# EAGLE design d7hb (EAGLE 7.2.0)
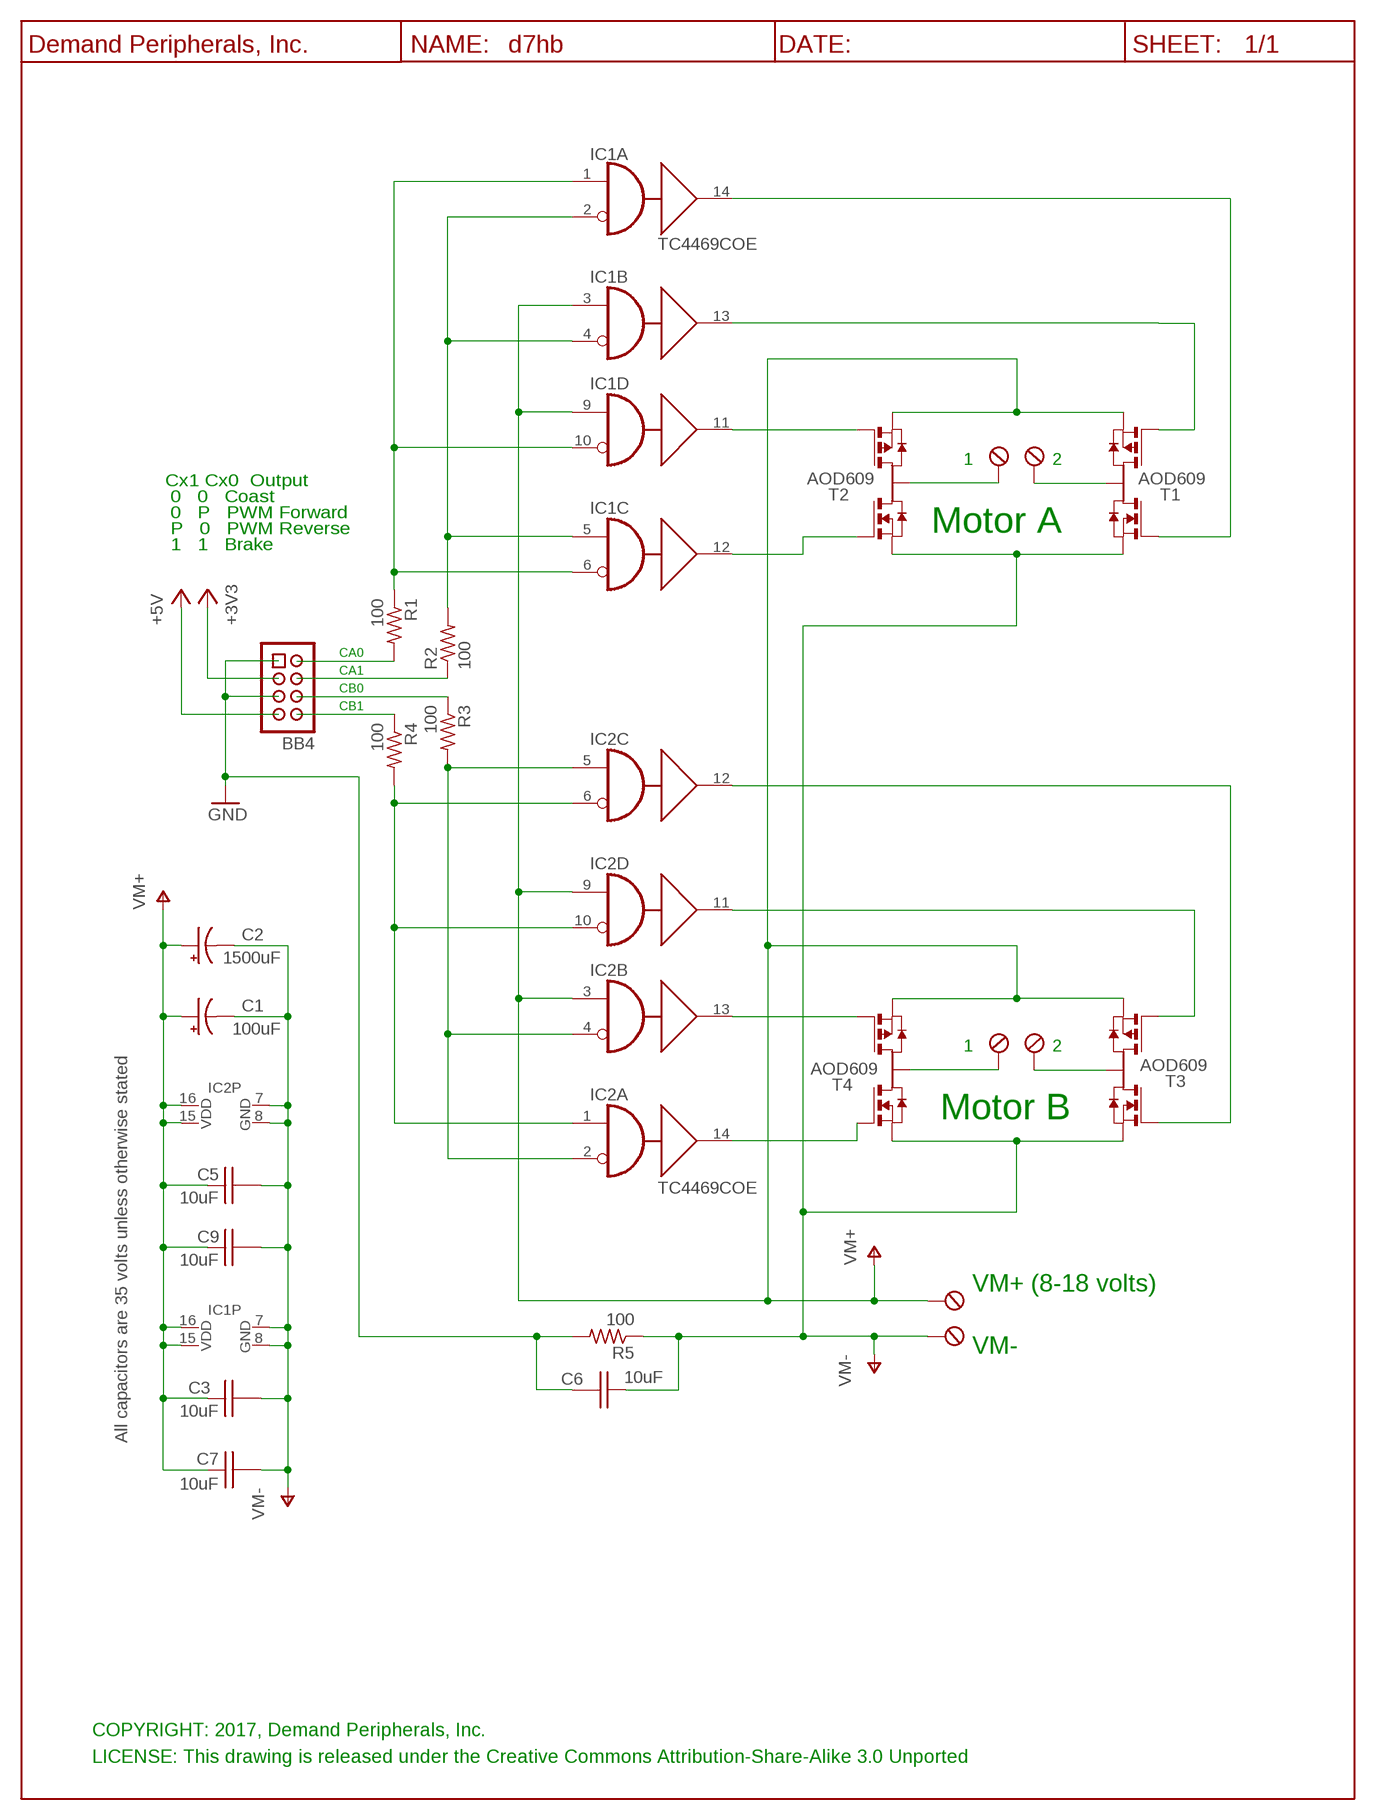
[diagram p0: schematic, sheet 1]

## Parts
BB4  BB_CON  HDR-4X2-SHR  [HDR-4X2]
C1  100uF  C100UF35V_E3.5-8  [E3.5-8]
C2  1500uF  C1500UF35V_E7,5-16  [E7,5-16]
C3  10uF  C10UF35V_C0805  [C0805]
C5  10uF  C10UF35V_C0805  [C0805]
C6  10uF  C10UF35V_C0805  [C0805]
C7  10uF  C10UF35V_C0805  [C0805]
C9  10uF  C10UF35V_C0805  [C0805]
CN1  OSTTC022162  TBLK-5.08-X2  [TBLK-5.08-X2]
CN2  OSTTC022162  TBLK-5.08-X2  [TBLK-5.08-X2]
CN3  OSTTC022162  TBLK-5.08-X2  [TBLK-5.08-X2]
IC1  TC4469COE  TC4469OESO-16DW  [SO-16DW]
IC2  TC4469COE  TC4469OESO-16DW  [SO-16DW]
R1  100  R100_R0603  [R0603]
R2  100  R100_R0603  [R0603]
R3  100  R100_R0603  [R0603]
R4  100  R100_R0603  [R0603]
R5  100  R100_R0603  [R0603]
T1  AOD609  [TO252-41]
T2  AOD609  [TO252-41]
T3  AOD609  [TO252-41]
T4  AOD609  [TO252-41]
U$1  DP_FRAME_P  [LETTER_P]

## Nets
+3V3: BB4.3
GND: BB4.1 BB4.5 C6.2 R5.2
N$1: IC1.12(C:Y) T2.2(G1N)
N$3: IC1.11(D:Y) T2.5(G2P)
N$4: IC1.13(B:Y) T1.5(G2P)
N$5: IC1.14(A:Y) T1.2(G1N)
N$6: IC2.13(B:Y) T4.5(G2P)
N$8: BB4.8 R4.1
N$9: IC2.14(A:Y) T4.2(G1N)
N$11: IC2.11(D:Y) T3.5(G2P)
N$12: BB4.2 R1.2
N$13: IC2.12(C:Y) T3.2(G1N)
N$15: BB4.4 R2.1
N$16: IC1.1(A:A) IC1.6(C:B) IC1.10(D:B) R1.1
N$17: IC1.2(A:B) IC1.4(B:B) IC1.5(C:A) R2.2
N$18: BB4.6 R3.1
N$20: IC2.1(A:A) IC2.6(C:B) IC2.10(D:B) R4.2
N$21: IC2.2(A:B) IC2.4(B:B) IC2.5(C:A) R3.2
N$85: CN3.1(KL) T2.CASE(D12)
N$86: CN3.2(KL1) T1.CASE(D12)
N$87: CN2.2(KL1) T4.CASE(D12)
N$88: CN2.1(KL) T3.CASE(D12)
V+: C1.+ C2.+ C3.1 C5.1 C7.1 C9.1 CN1.2(KL1) IC1.3(B:A) IC1.9(D:A) IC1.15(P:VDD) IC1.16(P:VDD) IC2.3(B:A) IC2.9(D:A) IC2.15(P:VDD) IC2.16(P:VDD) T1.4(S2P) T2.4(S2P) T3.4(S2P) T4.4(S2P) ; supply symbol labelled VM+
V-: C1.- C2.- C3.2 C5.2 C6.1 C7.2 C9.2 CN1.1(KL) IC1.7(P:GND) IC1.8(P:GND) IC2.7(P:GND) IC2.8(P:GND) R5.1 T1.1(S1N) T2.1(S1N) T3.1(S1N) T4.1(S1N) ; supply symbol labelled VM-
VCC: BB4.7 ; supply symbol labelled +5V

## Notes on the sheet
- 1 | 2
- Cx1 Cx0  Output
- 0   0   Coast
- 0   P   PWM Forward
- P   0   PWM Reverse | Motor A
- 1   1   Brake
- CA0
- CA1
- CB0
- CB1
- 1 | 2
- Motor B
- VM+ (8-18 volts)
- VM-
- All capacitors are 35 volts unless otherwise stated
- COPYRIGHT: 2017, Demand Peripherals, Inc.
- LICENSE: This drawing is released under the Creative Commons Attribution-Share-Alike 3.0 Unported

## Library data of the parts
BB4 = dpi-conn:HDR-4X2-SHR: Shrouded 4x2 pin header; VENDOR: Digikey; VENDOR-PART-NUM: 609-3530-ND
C1 = dpi-passive:C100UF35V_: 100uF polarized capacitor, 35 volts, general purpose; VENDOR: Digikey; VENDOR-PART-NUM: 399-6548-ND
C2 = dpi-passive:C1500UF35V_: 1500uF polarized capacitor, 35 volts, general purpose; VENDOR: Digikey; VENDOR-PART-NUM: 399-6559-ND
C3 C5-C7 C9 = dpi-passive:C10UF35V_: 10 uF Capacitor, 35V, X6S; VENDOR: Digikey; VENDOR-PART-NUM: 490-10504-2-ND
CN1-CN3 = dpi-conn:TBLK-5.08-X2: Terminal Block, 5.08mm, x2, screw terminals; VENDOR: Digikey; VENDOR-PART-NUM: ED2609-ND
IC1 IC2 = dpi-transic:TC4469OE: Logic-Input CMOS Quad Drivers Source: TC 4469-MOSFET-DRIVER.pdf; VENDOR: Digikey; VENDOR-PART-NUM: TC4469COE713CT-ND
R1-R5 = dpi-passive:R100_: 100 Ohm resistor, 1%, 0.1 watt; VENDOR: Digikey; VENDOR-PART-NUM: 311-100HRTR-ND
T1-T4 = dpi-transic:AOD609: DUAL N AND P-CHANNEL MOSFET; VENDOR: Digikey; VENDOR-PART-NUM: 785-1607-1-ND
U$1 = DP:DP_FRAME_P: Portrait/Letter Document Frame

## Board
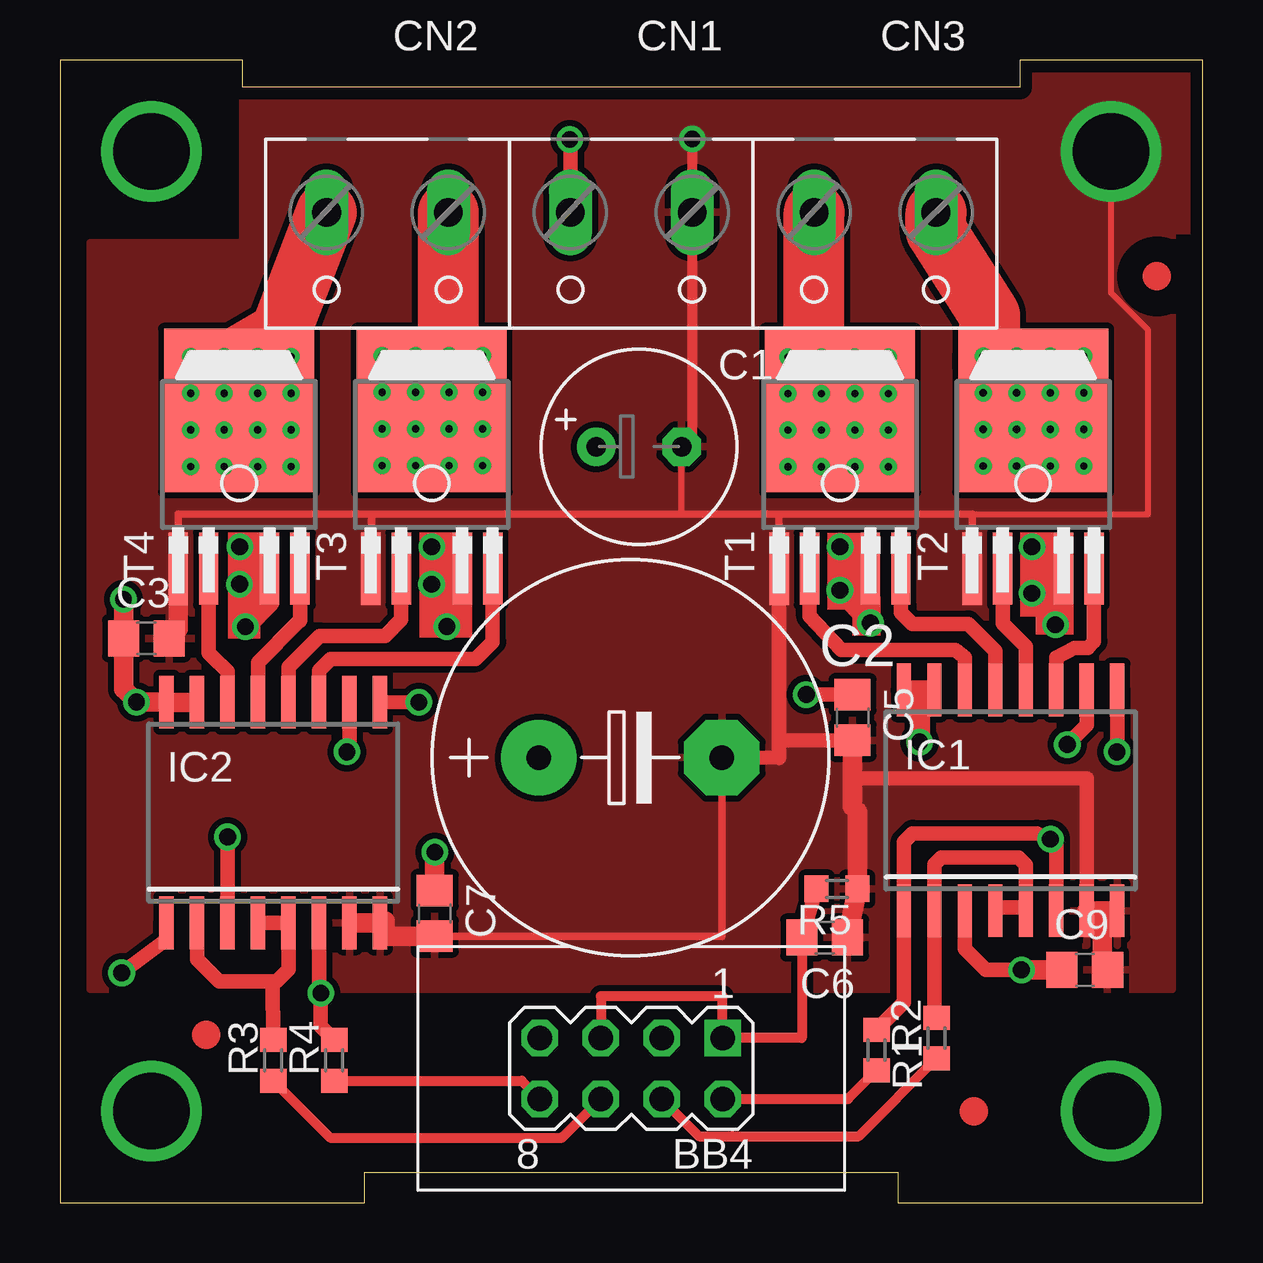
[diagram p1: board, top side]
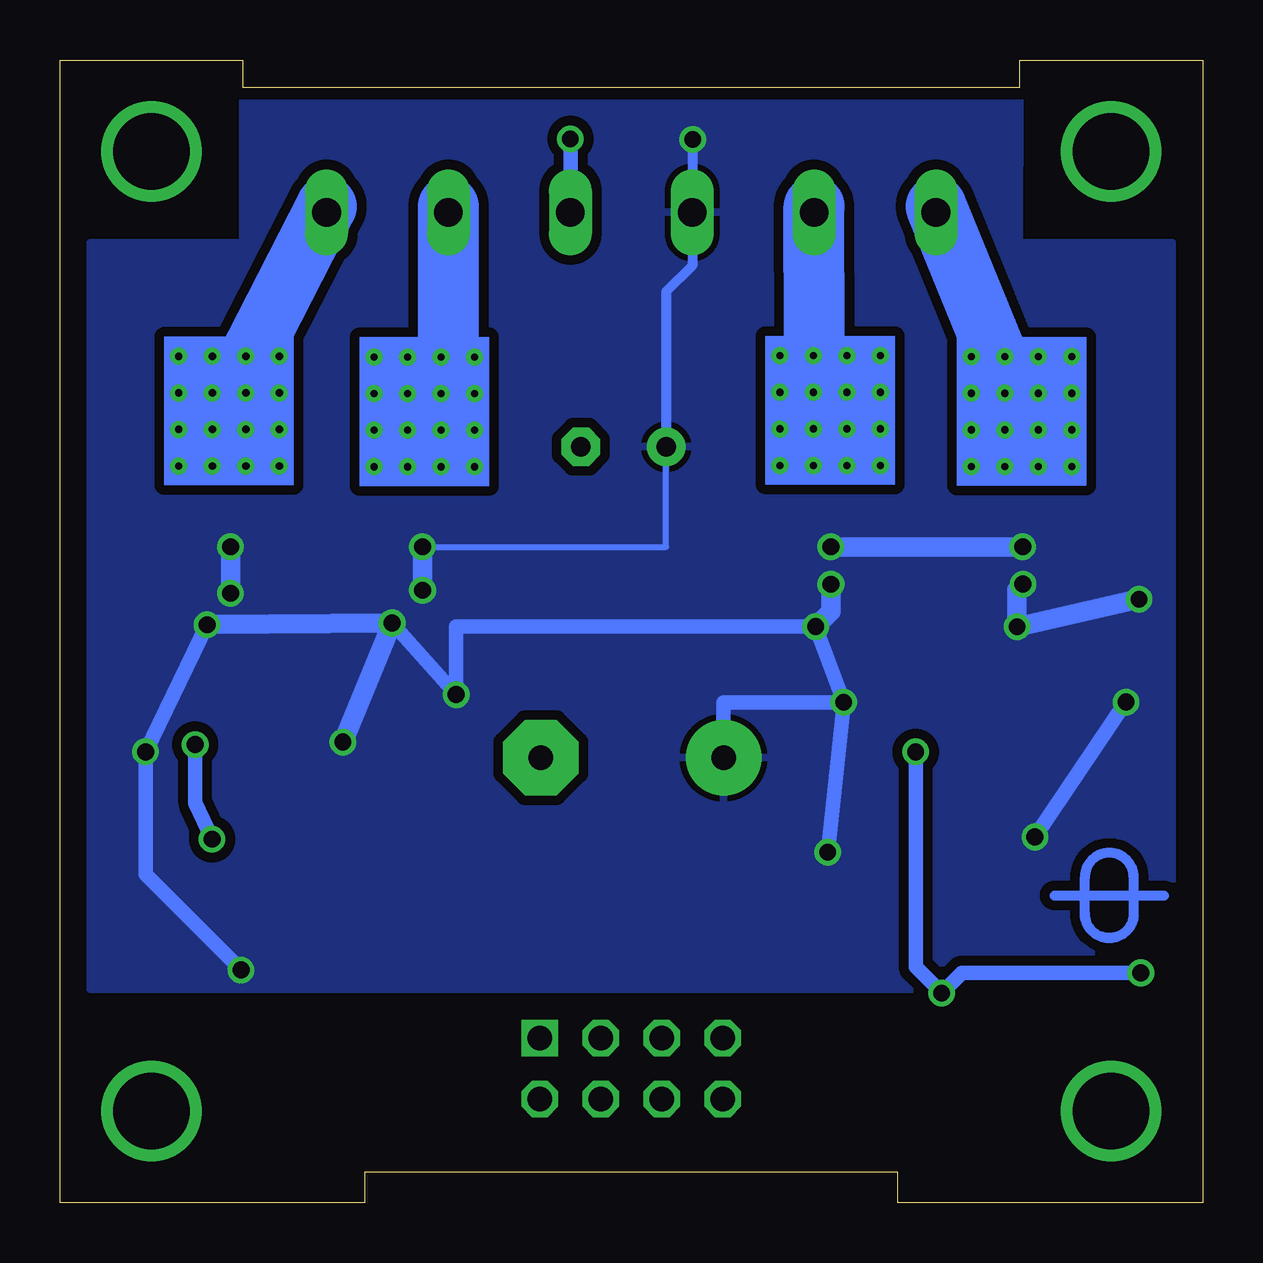
[diagram p2: board, bottom side, seen from below]

Size 47.62 x 47.62 mm. Coordinates in mm from the lower left corner, seen from the top.
Outline: 0,0 12.7,0 12.7,1.27 34.92,1.27 34.92,0 47.62,0 47.62,47.62 40.01,47.62 40.01,46.48 7.62,46.48 7.62,47.62 0,47.62 0,0
Copper layers (1*16): Top 0.035mm / dielectric 1.5mm / Bottom 0.035mm
Design rules "default *": minimum track width 10mil, minimum drill 24mil, track to track 10mil, track to pad 10mil, pad to pad 10mil, via to via 10mil, smd to smd 10mil, copper to edge 20mil, drill to drill 12mil, minimum pad ring 10mil, minimum via ring 8mil, stop-mask expansion 4mil, vias tented up to drill 0mil, thermal gap 10mil
tKeepout: area 15.1,0.5 to 32.5,9.7

### Footprints (pad centres in the part's own frame; a part is rotated, then mirrored left to right if it is on the bottom)
HDR-4X2 = drill 1.016 square: 1 -3.81,-1.27 | drill 1.016 octagon: 2 -3.81,1.27; 3 -1.27,-1.27; 4 -1.27,1.27; 5 1.27,-1.27; 6 1.27,1.27; 7 3.81,-1.27; 8 3.81,1.27
E3.5-8 = drill 0.813 pad 1.6: + -1.778,0 | drill 0.813 pad 1.6 octagon: - 1.778,0
E7,5-16 = drill 1.016 pad 3.15: + -3.81,0 | drill 1.016 pad 3.15 octagon: - 3.81,0
C0805 = smd 1.3 x 1.5: 1 -0.95,0; 2 0.95,0
TBLK-5.08-X2 = drill 1.194 long: 1 -2.54,-0.127; 2 2.54,-0.127
SO-16DW = smd 0.6 x 2.2: 1 -4.445,-4.6; 2 -3.175,-4.6; 3 -1.905,-4.6; 4 -0.635,-4.6; 5 0.635,-4.6; 6 1.905,-4.6; 7 3.175,-4.6; 8 4.445,-4.6; 9 4.445,4.6; 10 3.175,4.6; 11 1.905,4.6; 12 0.635,4.6; 13 -0.635,4.6; 14 -1.905,4.6; 15 -3.175,4.6; 16 -4.445,4.6
R0603 = smd 1 x 1.1: 1 -0.85,0; 2 0.85,0
TO252-41 = smd 0.81 x 3.02: 1 -2.54,-6.6 | smd 0.81 x 3: 2 -1.27,-6.6; 4 1.27,-6.6; 5 2.54,-6.6 | smd 6.25 x 6.8: CASE 0,0

### Placement (x,y rotation side)
BB4  23.81,5.59 180 top
C1  24.14,31.5 0 top
C2  23.77,18.54 0 top
C3  3.6,23.52 0 top
C5  33.04,20.22 270 top
C6  31.87,11.05 180 top
C7  15.62,12.05 270 top
C9  42.72,9.7 0 top
CN1  23.81,41.15 180 top
CN2  13.65,41.15 180 top
CN3  33.97,41.15 180 top
IC1  39.62,16.76 0 top
IC2  8.89,16.26 0 top
R1  34.04,6.35 270 top
R2  36.54,6.86 90 top
R3  8.89,5.93 90 top
R4  11.43,5.93 90 top
R5  32.39,13.08 180 top
T1  32.51,33.02 0 top
T2  40.56,33.02 0 top
T3  15.49,33.02 0 top
T4  7.47,33.02 0 top
U$1  -2.54,-2.54 0 top
U$2  [FIDUCIAL]  6.1,6.99 0 top
U$3  [FIDUCIAL]  38.1,3.81 0 top
U$4  [FIDUCIAL]  45.72,38.61 0 top
U$5  [DPI-1]  3.89,12.8 90 bottom

### Tracks (layer width: path | path; a pad name or v marks a point on that pad's centre or on a via)
GND
  Top 0.406: C6.2 30.92,6.86 BB4.1 27.62,8.6 22.91,8.6 22.54,8.6 BB4.5
  Top 0.61: C6.2 R5.2
N$1
  Top 0.61: IC1.12 40.26,23.17 39.29,24.14 T2.2
N$2  (via drill 0.3)
  other vias: 17.61,30.72
N$3
  Top 0.61: IC1.11 41.53,22.73 42.28,23.12 42.84,23.12 43.1,23.39 T2.5
N$4
  Top 0.61: IC1.13 38.99,22.99 37.86,24.12 35.53,24.12 35.05,24.6 T1.5
N$5
  Top 0.61: IC1.14 37.72,22.72 37.32,23.03 32.56,23.03 31.24,24.44 T1.2
N$6
  Top 0.61: IC2.13 8.26,22.51 9.9,24.15 10.01,24.26 T4.5
N$7  (via drill 3.17 pad 3.17)
  other vias: 3.81,3.81
N$8
  Top 0.406: R4.1 19.24,5.08 BB4.8
N$9
  Top 0.61: IC2.14 6.99,22.13 6.35,22.76 6.2,22.91 T4.2
N$10  (via drill 3.17 pad 3.17)
  other vias: 3.81,43.81
N$11
  Top 0.61: IC2.11 10.79,22.17 11.28,22.66 17.32,22.66 18.03,23.37 T3.5
N$12
  Top 0.406: BB4.2 32.85,4.32 R1.2
N$13
  Top 0.61: T3.2 14.22,24.3 13.54,23.62 10.83,23.62 10.71,23.5 9.53,22.32 IC2.12
N$15
  Top 0.406: BB4.4 26.63,2.77 28.03,2.77 33.3,2.77 R2.1
N$16  (via drill 0.7)
  Top 0.61: R1.1 35.18,8.35 IC1.1 35.18,15.03 35.32,15.18 35.53,15.39 40.71,15.39 v41.28,15.15 41.53,15.04 IC1.6 | IC1.10 42.8,19.9 v41.99,19.09
  Bottom 0.61: v41.99,19.09 41.99,16.66 v41.28,15.15
N$17
  Top 0.61: 40.26,12.31 40.26,14.08 40.1,14.24 39.95,14.38 36.73,14.38 36.45,14.1 IC1.2 36.45,7.8 R2.2 | 40.26,12.31 IC1.5 | IC1.4 39.13,12.31 40.26,12.31
N$18
  Top 0.406: R3.1 11.27,2.71 20.89,2.71 20.93,2.71 BB4.6
N$19  (via drill 0.3)
  other vias: 16.22,30.72
N$20  (via drill 0.7)
  Top 0.61: IC2.6 10.79,8.81 v10.87,8.73 10.87,7.34 R4.2 | v2.57,9.57 4.44,10.96 IC2.1 | IC2.10 12.06,18.89 v11.96,18.78
  Bottom 0.61: v2.57,9.57 10.03,9.57 v10.87,8.73 11.96,9.82 v11.96,18.78
N$21
  Top 0.61: IC2.2 5.71,10.14 6.63,9.22 8.87,9.22 | 8.87,9.22 9.03,9.22 9.38,9.57 9.53,9.72 IC2.5 IC2.4 | R3.2 8.87,9.22
N$22  (via drill 0.3)
  other vias: 13.42,30.72
N$23  (via drill 0.3)
  other vias: 16.22,33.77
N$24  (via drill 0.3)
  other vias: 13.42,35.3
N$25  (via drill 0.3)
  other vias: 13.42,33.77
N$26  (via drill 0.3)
  other vias: 13.42,32.25
N$27  (via drill 0.3)
  other vias: 14.82,32.25
N$28  (via drill 0.3)
  other vias: 14.82,33.77
N$29  (via drill 3.17 pad 3.17)
  other vias: 43.81,3.81
N$30  (via drill 0.3)
  other vias: 16.22,35.3
N$31  (via drill 0.3)
  other vias: 17.61,35.3
N$32  (via drill 0.3)
  other vias: 16.22,32.25
N$33  (via drill 0.3)
  other vias: 14.82,35.3
N$34  (via drill 0.3)
  other vias: 14.82,30.72
N$35  (via drill 0.3)
  other vias: 17.61,32.25
N$36  (via drill 0.3)
  other vias: 17.61,33.77
N$37  (via drill 0.3)
  other vias: 42.67,30.7
N$38  (via drill 0.3)
  other vias: 41.27,30.7
N$39  (via drill 0.3)
  other vias: 38.48,30.7
N$40  (via drill 0.3)
  other vias: 41.27,33.75
N$41  (via drill 0.3)
  other vias: 38.48,35.27
N$42  (via drill 0.3)
  other vias: 38.48,33.75
N$43  (via drill 0.3)
  other vias: 38.48,32.23
N$44  (via drill 0.3)
  other vias: 39.88,32.23
N$45  (via drill 0.3)
  other vias: 39.88,33.75
N$46  (via drill 0.3)
  other vias: 41.27,35.27
N$47  (via drill 0.3)
  other vias: 42.67,35.27
N$48  (via drill 0.3)
  other vias: 41.27,32.23
N$49  (via drill 0.3)
  other vias: 39.88,35.27
N$50  (via drill 0.3)
  other vias: 39.88,30.7
N$51  (via drill 0.3)
  other vias: 42.67,32.23
N$52  (via drill 0.3)
  other vias: 42.67,33.75
N$53  (via drill 0.3)
  other vias: 34.53,30.67
N$54  (via drill 0.3)
  other vias: 33.13,30.67
N$55  (via drill 0.3)
  other vias: 30.34,30.67
N$56  (via drill 0.3)
  other vias: 33.13,33.72
N$57  (via drill 0.3)
  other vias: 30.34,35.24
N$58  (via drill 0.3)
  other vias: 30.34,33.72
N$59  (via drill 0.3)
  other vias: 30.34,32.19
N$60  (via drill 0.3)
  other vias: 31.74,32.19
N$61  (via drill 0.3)
  other vias: 31.74,33.72
N$62  (via drill 0.3)
  other vias: 33.13,35.24
N$63  (via drill 0.3)
  other vias: 34.53,35.24
N$64  (via drill 0.3)
  other vias: 33.13,32.19
N$65  (via drill 0.3)
  other vias: 31.74,35.24
N$66  (via drill 0.3)
  other vias: 31.74,30.67
N$67  (via drill 0.3)
  other vias: 34.53,32.19
N$68  (via drill 0.3)
  other vias: 34.53,33.72
N$69  (via drill 0.3)
  other vias: 9.64,30.68
N$70  (via drill 0.3)
  other vias: 8.24,30.68
N$71  (via drill 0.3)
  other vias: 5.45,30.68
N$72  (via drill 0.3)
  other vias: 8.24,33.73
N$73  (via drill 0.3)
  other vias: 5.45,35.26
N$74  (via drill 0.3)
  other vias: 5.45,33.73
N$75  (via drill 0.3)
  other vias: 5.45,32.21
N$76  (via drill 0.3)
  other vias: 6.85,32.21
N$77  (via drill 0.3)
  other vias: 6.85,33.73
N$78  (via drill 0.3)
  other vias: 8.24,35.26
N$79  (via drill 0.3)
  other vias: 9.64,35.26
N$80  (via drill 0.3)
  other vias: 8.24,32.21
N$81  (via drill 0.3)
  other vias: 6.85,35.26
N$82  (via drill 0.3)
  other vias: 6.85,30.68
N$83  (via drill 0.3)
  other vias: 9.64,32.21
N$84  (via drill 0.3)
  other vias: 9.64,33.73
N$85
  Top 2.54: CN3.1 36.51,40.51 38.75,36.97 38.71,34.87 T2.CASE
N$86
  Top 2.54: CN3.2 31.43,33.02 T1.CASE
N$87
  Top 2.54: CN2.2 9.19,36.27 7.44,35.26 7.44,33.05
  Top 3.81: T4.CASE 7.44,33.05
N$88
  Top 2.54: 16.19,33.71 CN2.1
  Top 3.81: T3.CASE 15.05,33.06 15.59,33.11 16.19,33.71
N$89
  Bottom 2.54: 8.7,35.62 11.11,41.53
N$91
  Bottom 2.54: 16.19,35.99 16.19,41.53
N$92
  Bottom 2.54: 31.43,35.84 31.43,41.53
N$95
  Bottom 2.54: 39.54,35.63 36.51,41.53
V+  (via drill 0.7)
  Top 0.254: 5.53,20.85 5.53,20.86 IC2.15
  Top 0.61: v31.11,21.17 C5.1 | v44.06,18.78 44.07,18.8 IC1.9 | 36.14,21.36 IC1.15 | 35.47,21.36 IC1.16 | v14.96,20.85 IC2.9 | IC2.3 v6.99,15.24 | v40.08,9.69 38.6,9.69 37.72,10.57 IC1.3 | v21.25,44.31 21.27,44.28 CN1.2
  Top 0.813: T4.4 8.74,25 v7.73,24 | v7.49,25.78 v7.49,27.33 | v15.49,27.33 15.49,26.03 v15.49,25.77 | v16.13,24.01 16.76,24.64 T3.4 | v40.51,27.33 T2.4 | v41.49,24.08 v40.51,25.4 | v33.78,24.16 v32.51,25.52 | v32.51,27.33 T1.4 | v40.08,9.69 C9.1 | v2.65,25.15 C3.1 2.65,21.4 v3.19,20.86 IC2.16 5.53,20.85 | 35.86,21.36 35.47,21.36 | 35.86,21.36 36.14,21.36 | v35.83,19.2 35.86,19.22 35.86,21.36 | v15.62,14.61 C7.1
  Bottom 0.254: v32.51,27.33 22.36,27.33 C1.+
  Bottom 0.406: C1.+ 22.36,37.97 21.25,39.08 v21.25,44.31
  Bottom 0.61: v41.49,24.08 v44.06,18.78 44.06,13.67 v40.08,9.69 | v33.78,24.16 v31.11,21.17 31.11,24.01 v16.13,24.01 v14.96,20.85 | v14.96,20.85 v15.62,14.61 | v6.99,15.24 v3.19,20.86 | C2.+ 19.97,20.85 v14.96,20.85
  Bottom 0.813: v7.49,25.78 7.73,25.53 v7.73,24 v2.65,25.15 | v15.49,25.77 15.5,24.64 v16.13,24.01 | v7.49,27.33 v15.49,27.33 | v40.51,25.4 v40.51,27.33 | v41.49,24.08 v33.78,24.16 v35.83,19.2 | v32.51,25.52 v32.51,27.33
  pour Bottom (isolate 0.406): 1.27,8.89 1.27,40.01 7.64,40.01 7.62,46.35 40.01,46.35 40.01,40.01 46.35,40.01 46.35,8.89
V-  (via drill 0.7, 3.17 pad 3.17)
  Top 0.254: 43.02,12.16 | IC1.7 43.02,12.16 | 26.48,28.7 25.91,28.7 C1.- | v43.81,43.81 43.81,37.91 45.35,36.37 45.35,28.7 38.02,28.7
  Top 0.305: 12.99,28.7 4.93,28.7 T4.1 | T3.1 12.99,26.42 12.99,28.7 | 29.97,28.7 T1.1 | 12.99,28.7 26.48,28.7 29.97,28.7 | T2.1 38.02,28.7 29.97,28.7 | 43.9,12.16 | 43.9,12.16 IC1.8 | C7.2 27.59,11.1 C2.-
  Top 0.406: v26.35,44.34 26.35,31.94 C1.-
  Top 0.61: T1.1 29.97,19.27 | 29.97,19.27 C5.2 | IC2.7 12.18,11.66 | IC1.7 42.8,17.68 33.04,17.68 | C2.- 29.96,18.53 29.97,19.27
  Top 0.813: C9.2 43.45,9.91 43.45,12.16 | 43.45,12.16 43.9,12.16 | 43.02,12.16 43.45,12.16 | C6.1 R5.1 33.23,16.3 33.04,16.5 33.04,17.68 C5.2 | C3.2 4.93,23.9 T4.1 | 12.18,11.66 IC2.8 arc-74 13.54,11.73 13.54,11.1 C7.2 | IC1.7
  Bottom 0.61: v26.35,44.34 CN1.1
  pour Top (isolate 0.254): 1.27,8.89 1.27,40.01 7.62,40.01 7.62,46.35 40.51,46.35 40.51,47.12 47.12,47.12 47.12,40.51 46.35,40.51 46.35,8.89
(copper drawn outside any net)
  shapes: Bottom area x4, Top area x6

### Text on the board
tTest: 1.875 Inches | 1.575 Inches | B | 1 | 2 | V+ | V- | 2 | 1 | A | (C) 2019, Demand Peripherals, Inc. | T4 | T2 | T3 | T1 | + | C1 | C3 | C5 | C2 | (optional) | + | IC2 | IC1 | D7HB, Rev 19A | 1.575 Inches | 1.875 Inches | R5 | C7 | C6 | C9 | R1 | R2 | R3 | R4